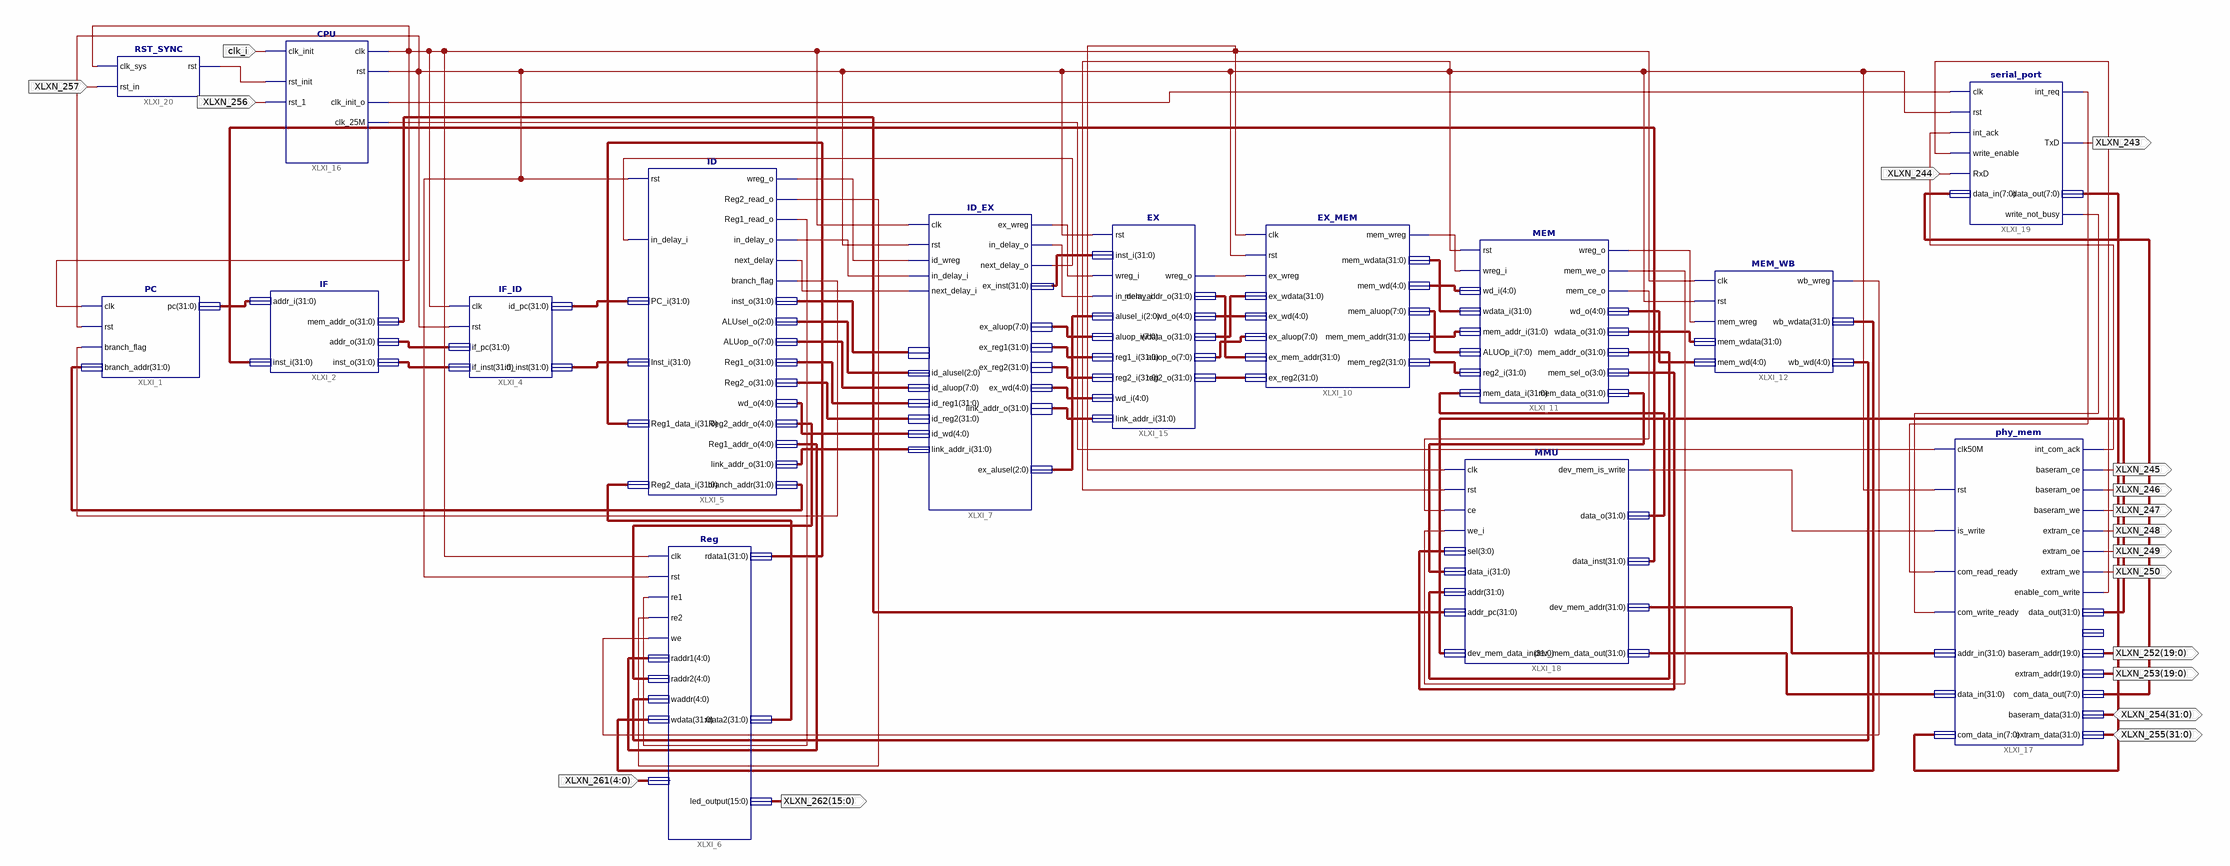
[diagram p0: schematic sheet 1]
// Xilinx ISE schematic simplemipst.sch (spartan6) as structural Verilog: 15 symbols, 17 ports
module simplemipst (
  input  clk_i,
  input  XLXN_244,
  input  XLXN_256,
  input  XLXN_257,
  input  [4:0] XLXN_261,
  inout  [31:0] XLXN_254,
  inout  [31:0] XLXN_255,
  output XLXN_243,
  output XLXN_245,
  output XLXN_246,
  output XLXN_247,
  output XLXN_248,
  output XLXN_249,
  output XLXN_250,
  output [19:0] XLXN_252,
  output [19:0] XLXN_253,
  output [15:0] XLXN_262
);

  wire XLXN_24, XLXN_32, XLXN_35, XLXN_39, XLXN_43, XLXN_53, XLXN_78, XLXN_79, XLXN_93, XLXN_100, XLXN_104,
       XLXN_108, XLXN_109, XLXN_119, XLXN_125, XLXN_126, XLXN_128, XLXN_129, XLXN_221, XLXN_222, XLXN_235,
       XLXN_236, XLXN_239, XLXN_240, XLXN_242;
  wire [2:0] XLXN_37, XLXN_258;
  wire [3:0] XLXN_107;
  wire [4:0] XLXN_17, XLXN_20, XLXN_30, XLXN_33, XLXN_58, XLXN_75, XLXN_80, XLXN_95;
  wire [7:0] XLXN_29, XLXN_38, XLXN_72, XLXN_85, XLXN_127, XLXN_130;
  wire [31:0] XLXN_4, XLXN_8, XLXN_12, XLXN_13, XLXN_14, XLXN_16, XLXN_25, XLXN_26, XLXN_27, XLXN_28,
       XLXN_31, XLXN_34, XLXN_36, XLXN_56, XLXN_73, XLXN_74, XLXN_76, XLXN_77, XLXN_82, XLXN_83, XLXN_84,
       XLXN_94, XLXN_105, XLXN_106, XLXN_110, XLXN_111, XLXN_112, XLXN_118, XLXN_120, XLXN_121, XLXN_122,
       XLXN_123;

  CPU XLXI_16 (
    .clk_init(clk_i), .rst_init(XLXN_236), .clk(XLXN_242), .rst(XLXN_235), .rst_1(XLXN_256),
    .clk_init_o(XLXN_240), .clk_25M(XLXN_239));
  PC XLXI_1 (.clk(XLXN_242), .rst(XLXN_235), .branch_flag(XLXN_24), .branch_addr(XLXN_26), .pc(XLXN_4));
  IF XLXI_2 (.addr_i(XLXN_4), .inst_i(XLXN_121), .mem_addr_o(XLXN_112), .addr_o(XLXN_8), .inst_o(XLXN_25));
  IF_ID XLXI_4 (.clk(XLXN_242), .rst(XLXN_235), .if_pc(XLXN_8), .if_inst(XLXN_25), .id_pc(XLXN_12), .id_inst(XLXN_13));
  ID XLXI_5 (
    .rst(XLXN_235), .in_delay_i(XLXN_78), .PC_i(XLXN_12), .Inst_i(XLXN_13), .Reg1_data_i(XLXN_14),
    .Reg2_data_i(XLXN_16), .wreg_o(XLXN_53), .Reg2_read_o(XLXN_100), .Reg1_read_o(XLXN_39),
    .in_delay_o(XLXN_43), .next_delay(XLXN_104), .branch_flag(XLXN_24), .inst_o(XLXN_36), .ALUsel_o(XLXN_37),
    .ALUop_o(XLXN_38), .Reg1_o(XLXN_56), .Reg2_o(XLXN_106), .wd_o(XLXN_58), .Reg2_addr_o(XLXN_20),
    .Reg1_addr_o(XLXN_17), .link_addr_o(XLXN_105), .branch_addr(XLXN_26));
  Reg XLXI_6 (
    .clk(XLXN_242), .rst(XLXN_235), .re1(XLXN_39), .re2(XLXN_100), .we(XLXN_93), .raddr1(XLXN_17),
    .raddr2(XLXN_20), .waddr(XLXN_95), .wdata(XLXN_94), .reg_addr(XLXN_261), .rdata1(XLXN_14),
    .rdata2(XLXN_16), .led_output(XLXN_262));
  MEM_WB XLXI_12 (
    .clk(XLXN_242), .rst(XLXN_235), .mem_wreg(XLXN_35), .mem_wdata(XLXN_34), .mem_wd(XLXN_33),
    .wb_wreg(XLXN_93), .wb_wdata(XLXN_94), .wb_wd(XLXN_95));
  MEM XLXI_11 (
    .rst(XLXN_235), .wreg_i(XLXN_32), .wd_i(XLXN_30), .wdata_i(XLXN_31), .mem_addr_i(XLXN_28),
    .ALUOp_i(XLXN_29), .reg2_i(XLXN_27), .mem_data_i(XLXN_120), .wreg_o(XLXN_35), .mem_we_o(XLXN_109),
    .mem_ce_o(XLXN_108), .wd_o(XLXN_33), .wdata_o(XLXN_34), .mem_addr_o(XLXN_111), .mem_sel_o(XLXN_107),
    .mem_data_o(XLXN_110));
  EX_MEM XLXI_10 (
    .clk(XLXN_242), .rst(XLXN_235), .ex_wreg(XLXN_79), .ex_wdata(XLXN_82), .ex_wd(XLXN_80),
    .ex_aluop(XLXN_85), .ex_mem_addr(XLXN_83), .ex_reg2(XLXN_84), .mem_wreg(XLXN_32), .mem_wdata(XLXN_31),
    .mem_wd(XLXN_30), .mem_aluop(XLXN_29), .mem_mem_addr(XLXN_28), .mem_reg2(XLXN_27));
  EX XLXI_15 (
    .rst(XLXN_235), .inst_i(XLXN_77), .wreg_i(XLXN_221), .in_delay_i(XLXN_222), .alusel_i(XLXN_258),
    .aluop_i(XLXN_72), .reg1_i(XLXN_73), .reg2_i(XLXN_74), .wd_i(XLXN_75), .link_addr_i(XLXN_76),
    .wreg_o(XLXN_79), .mem_addr_o(XLXN_83), .wd_o(XLXN_80), .wdata_o(XLXN_82), .aluop_o(XLXN_85),
    .reg2_o(XLXN_84));
  ID_EX XLXI_7 (
    .clk(XLXN_242), .rst(XLXN_235), .id_wreg(XLXN_53), .in_delay_i(XLXN_43), .next_delay_i(XLXN_104),
    .id_inst(XLXN_36), .id_alusel(XLXN_37), .id_aluop(XLXN_38), .id_reg1(XLXN_56), .id_reg2(XLXN_106),
    .id_wd(XLXN_58), .link_addr_i(XLXN_105), .ex_wreg(XLXN_221), .in_delay_o(XLXN_222),
    .next_delay_o(XLXN_78), .ex_inst(XLXN_77), .ex_aluop(XLXN_72), .ex_reg1(XLXN_73), .ex_reg2(XLXN_74),
    .ex_wd(XLXN_75), .link_addr_o(XLXN_76), .ex_alusel(XLXN_258));
  phy_mem XLXI_17 (
    .clk50M(XLXN_239), .rst(XLXN_235), .is_write(XLXN_119), .com_read_ready(XLXN_125),
    .com_write_ready(XLXN_126), .addr_in(XLXN_122), .data_in(XLXN_123), .com_data_in(XLXN_127),
    .int_com_ack(XLXN_128), .baseram_ce(XLXN_245), .baseram_oe(XLXN_246), .baseram_we(XLXN_247),
    .extram_ce(XLXN_248), .extram_oe(XLXN_249), .extram_we(XLXN_250), .enable_com_write(XLXN_129),
    .data_out(XLXN_118), .baseram_addr(XLXN_252), .extram_addr(XLXN_253), .com_data_out(XLXN_130),
    .baseram_data(XLXN_254), .extram_data(XLXN_255));  // open: segdisp
  serial_port XLXI_19 (
    .clk(XLXN_240), .rst(XLXN_235), .int_ack(XLXN_128), .write_enable(XLXN_129), .RxD(XLXN_244),
    .data_in(XLXN_130), .int_req(XLXN_125), .TxD(XLXN_243), .data_out(XLXN_127), .write_not_busy(XLXN_126));
  MMU XLXI_18 (
    .clk(XLXN_242), .rst(XLXN_235), .ce(XLXN_108), .we_i(XLXN_109), .sel(XLXN_107), .data_i(XLXN_110),
    .addr(XLXN_111), .addr_pc(XLXN_112), .dev_mem_data_in(XLXN_118), .dev_mem_is_write(XLXN_119),
    .data_o(XLXN_120), .data_inst(XLXN_121), .dev_mem_addr(XLXN_122), .dev_mem_data_out(XLXN_123));
  RST_SYNC XLXI_20 (.clk_sys(XLXN_242), .rst_in(XLXN_257), .rst(XLXN_236));
endmodule
